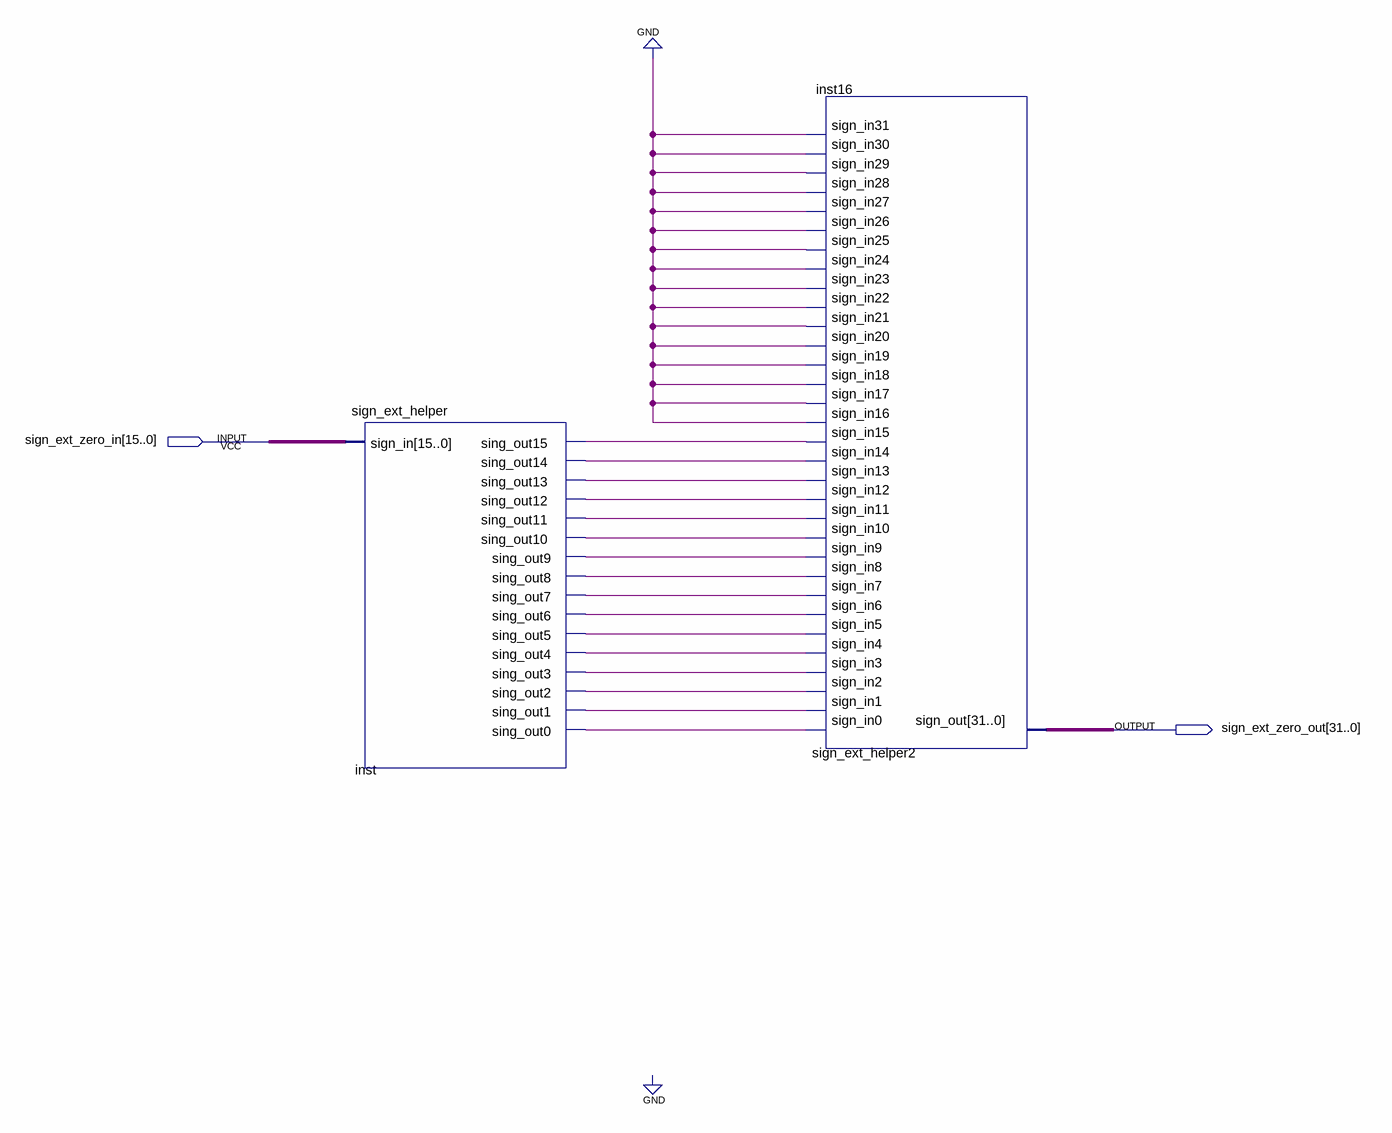
[diagram p0: schematic sheet]
// Quartus schematic sign_ext_zero.bdf as structural Verilog: 2 symbols, 2 pins
module sign_ext_zero (
  input  [15:0] sign_ext_zero_in,
  output [31:0] sign_ext_zero_out
);

  wire inst_sing_out0, inst_sing_out1, inst_sing_out2, inst_sing_out3, inst_sing_out4, inst_sing_out5,
       inst_sing_out6, inst_sing_out7, inst_sing_out8, inst_sing_out9, inst_sing_out10, inst_sing_out11,
       inst_sing_out12, inst_sing_out13, inst_sing_out14, inst_sing_out15;

  sign_ext_helper inst (
    .sign_in(sign_ext_zero_in), .sing_out15(inst_sing_out15), .sing_out14(inst_sing_out14),
    .sing_out13(inst_sing_out13), .sing_out12(inst_sing_out12), .sing_out11(inst_sing_out11),
    .sing_out10(inst_sing_out10), .sing_out9(inst_sing_out9), .sing_out8(inst_sing_out8),
    .sing_out7(inst_sing_out7), .sing_out6(inst_sing_out6), .sing_out5(inst_sing_out5),
    .sing_out4(inst_sing_out4), .sing_out3(inst_sing_out3), .sing_out2(inst_sing_out2),
    .sing_out1(inst_sing_out1), .sing_out0(inst_sing_out0));
  sign_ext_helper2 inst16 (
    .sign_in0(inst_sing_out0), .sign_in1(inst_sing_out1), .sign_in2(inst_sing_out2),
    .sign_in3(inst_sing_out3), .sign_in4(inst_sing_out4), .sign_in5(inst_sing_out5),
    .sign_in6(inst_sing_out6), .sign_in7(inst_sing_out7), .sign_in8(inst_sing_out8),
    .sign_in9(inst_sing_out9), .sign_in10(inst_sing_out10), .sign_in11(inst_sing_out11),
    .sign_in12(inst_sing_out12), .sign_in13(inst_sing_out13), .sign_in14(inst_sing_out14),
    .sign_in15(inst_sing_out15), .sign_in16(1'b0), .sign_in17(1'b0), .sign_in18(1'b0), .sign_in19(1'b0),
    .sign_in20(1'b0), .sign_in21(1'b0), .sign_in22(1'b0), .sign_in23(1'b0), .sign_in24(1'b0),
    .sign_in25(1'b0), .sign_in26(1'b0), .sign_in27(1'b0), .sign_in28(1'b0), .sign_in29(1'b0),
    .sign_in30(1'b0), .sign_in31(1'b0), .sign_out(sign_ext_zero_out));
endmodule
